# Altium project LMQ644_testpcb.PrjPcb
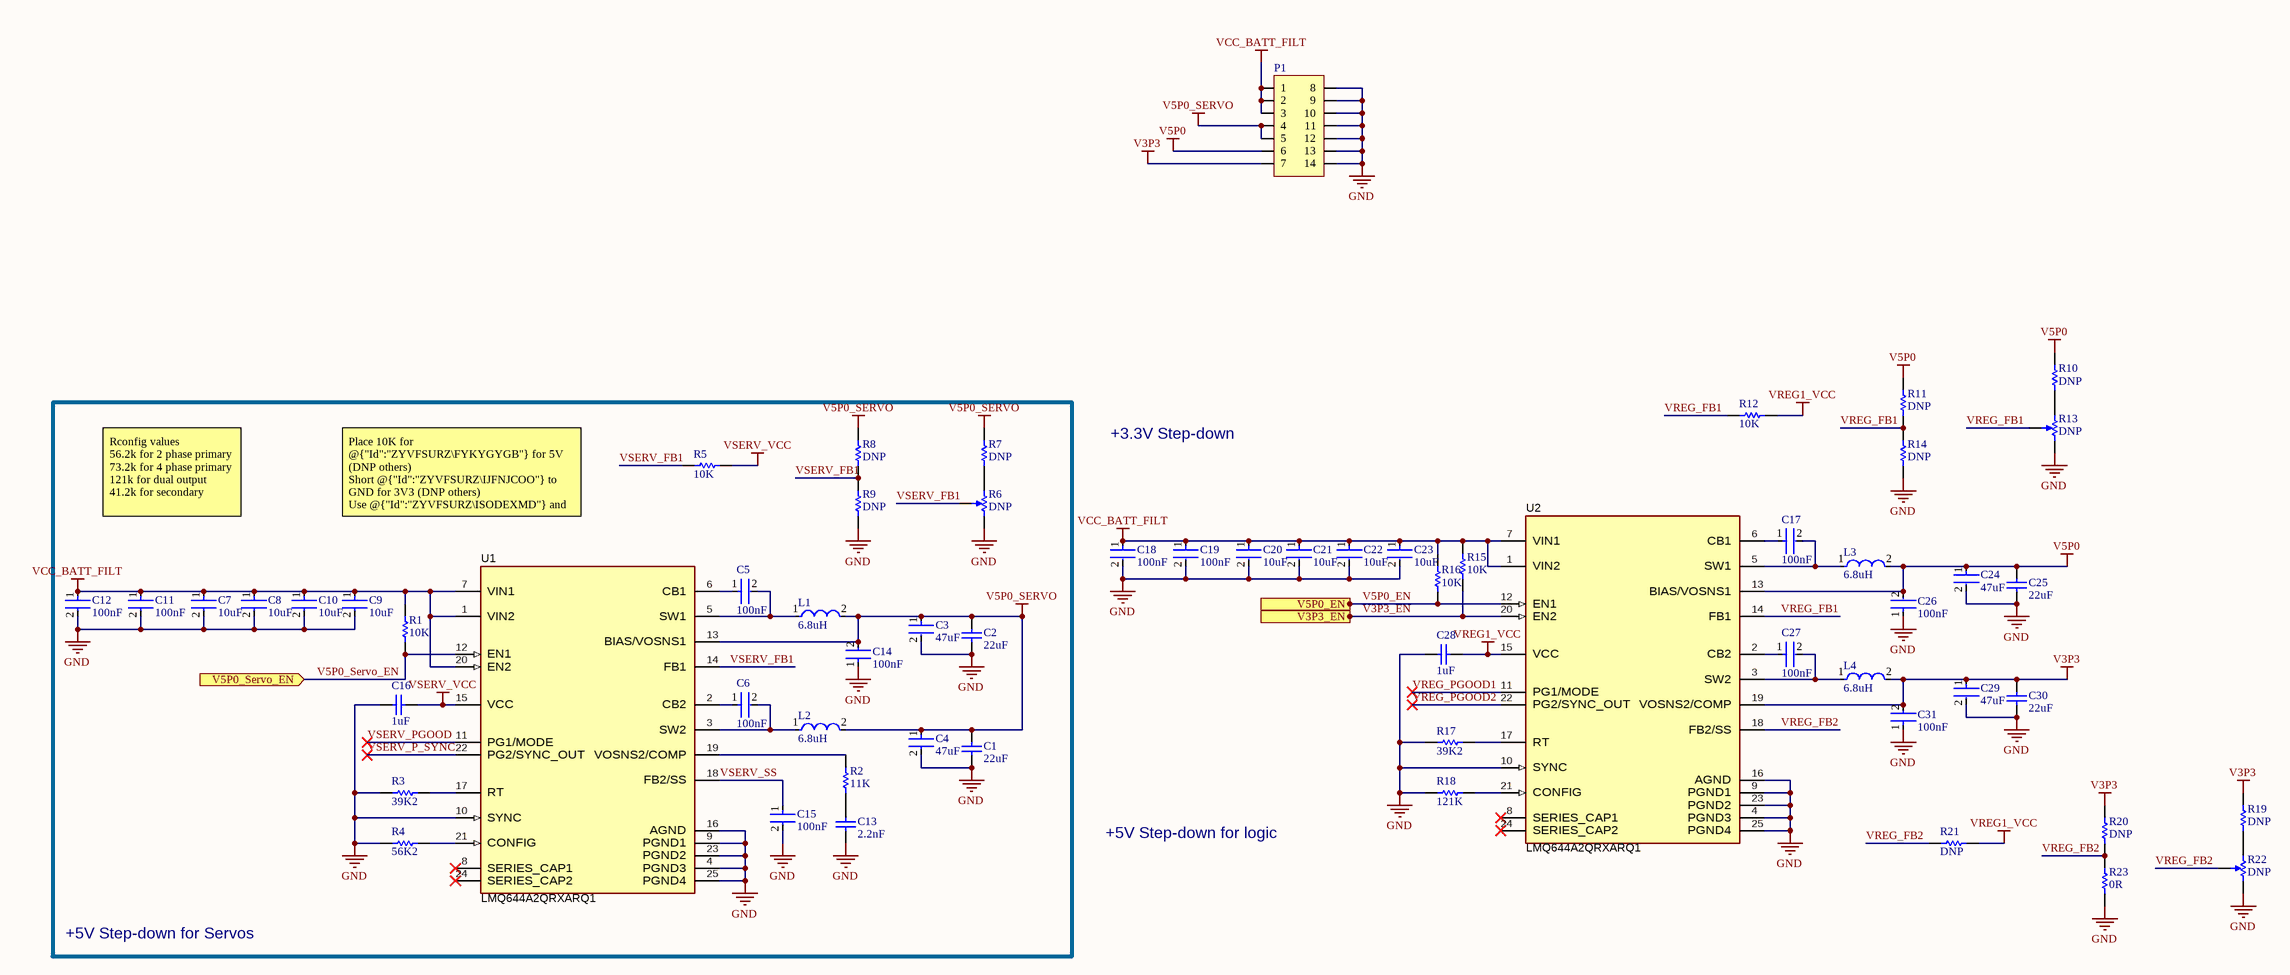
[diagram p0: LMQ644_test_SCH.SchDoc]
1 sheet, 61 parts. Net scope: flat (ports and power ports of the same name join across sheets).
Board file: LMQ644_test_PCB.PcbDoc

## Sheet LMQ644_test_SCH.SchDoc
size C; SheetNumber: 1; SheetTotal: 1

### Parts
C1  22uF  [CAPC1206(3216)190_L]
C2  22uF  [CAPC1206(3216)190_L]
C3  47uF  [FP-C3216-160-0_2-MFG]
C4  47uF  [FP-C3216-160-0_2-MFG]
C5  100nF  [FP-CGA3E-0_3-0_1-IPC_C]
C6  100nF  [FP-CGA3E-0_3-0_1-IPC_C]
C7  10uF  [FP-GRM32-MFG]
C8  10uF  [FP-GRM32-MFG]
C9  10uF  [FP-GRM32-MFG]
C10  10uF  [FP-GRM32-MFG]
C11  100nF  [FP-1206-L_3_2_0_2-W_1_6_0-MFG]
C12  100nF  [FP-1206-L_3_2_0_2-W_1_6_0-MFG]
C13  2.2nF  [CAPC1608X90X35NL10T15]
C14  100nF  [FP-CGA3E-0_3-0_1-IPC_C]
C15  100nF  [FP-CGA3E-0_3-0_1-IPC_C]
C16  1uF  [0603]
C17  100nF  [FP-CGA3E-0_3-0_1-IPC_C]
C18  100nF  [FP-1206-L_3_2_0_2-W_1_6_0-MFG]
C19  100nF  [FP-1206-L_3_2_0_2-W_1_6_0-MFG]
C20  10uF  [FP-GRM32-MFG]
C21  10uF  [FP-GRM32-MFG]
C22  10uF  [FP-GRM32-MFG]
C23  10uF  [FP-GRM32-MFG]
C24  47uF  [FP-C3216-160-0_2-MFG]
C25  22uF  [CAPC1206(3216)190_L]
C26  100nF  [FP-CGA3E-0_3-0_1-IPC_C]
C27  100nF  [FP-CGA3E-0_3-0_1-IPC_C]
C28  1uF  [0603]
C29  47uF  [FP-C3216-160-0_2-MFG]
C30  22uF  [CAPC1206(3216)190_L]
C31  100nF  [FP-CGA3E-0_3-0_1-IPC_C]
L1  6.8uH  [FP-IHLP-4040DZ-FP_3_124x3-MFG]
L2  6.8uH  [FP-IHLP-4040DZ-FP_3_124x3-MFG]
L3  6.8uH  [FP-IHLP-4040DZ-FP_3_124x3-MFG]
L4  6.8uH  [FP-IHLP-4040DZ-FP_3_124x3-MFG]
P1  14-Pin 2-Row Nano-Fit Right Angle  [MOLEX NANO-FIT 2X7 - Right Angle]  (value not drawn)
R1  10K  [0603]
R2  11K  [RESC1609X50X30LL10T20]
R3  39K2  [RESC1608X55X25LL10T15]
R4  56K2  [RESC1608X55X25LL10T15]
R5  10K  [0603]
R6  DNP  [BOUR-TC33X-2_V]  (no BOM)
R7  DNP  [0603]  (no BOM)
R8  DNP  [0603]
R9  DNP  [0603]
R10  DNP  [0603]  (no BOM)
R11  DNP  [0603]
R12  10K  [0603]
R13  DNP  [BOUR-TC33X-2_V]  (no BOM)
R14  DNP  [0603]  (no BOM)
R15  10K  [0603]
R16  10K  [0603]
R17  39K2  [RESC1608X55X25LL10T15]
R18  121K  [RESC1608X55X30LL15T15]
R19  DNP  [0603]  (no BOM)
R20  DNP  [0603]  (no BOM)
R21  DNP  [0603]  (no BOM)
R22  DNP  [BOUR-TC33X-2_V]  (no BOM)
R23  0R  [RESC1608X55X25LL10T15]
U1  LMQ644A2QRXARQ1  [RXA0024A-MFG]
U2  LMQ644A2QRXARQ1  [RXA0024A-MFG]

### Blocks framed on the sheet
+5V Step-down for Servos: C1-C16 L1 L2 R1-R9 U1

### Ports
V3P3_EN (in), V5P0_EN (in), V5P0_Servo_EN (in)

### Nets
GND: C1.1 C2.1 C3.2 C4.2 C7.2 C8.2 C9.2 C10.2 C11.2 C12.2 C13.2 C14.1 C15.2 C16.2 C18.2 C19.2 C20.2 C21.2 C22.2 C23.2 C24.2 C25.1 C26.1 C28.2 C29.2 C30.1 C31.1 P1.8 P1.9 P1.10 P1.11 P1.12 P1.13 P1.14 R3.1 R4.1 R6.3 R9.2 R13.3 R14.2 R17.1 R18.1 R22.3 R23.1 U1.4(PGND3) U1.9(PGND1) U1.10(SYNC) U1.16(AGND) U1.23(PGND2) U1.25(PGND4) U2.4(PGND3) U2.9(PGND1) U2.10(SYNC) U2.16(AGND) U2.23(PGND2) U2.25(PGND4)
V3P3: C29.1 C30.2 C31.2 L4.2 P1.7 R19.1 R20.1 U2.19(VOSNS2/COMP)
V5P0: C24.1 C25.2 C26.2 L3.2 P1.6 R10.1 R11.1 U2.13(BIAS/VOSNS1)
V5P0_SERVO: C1.2 C2.2 C3.1 C4.1 C14.2 L1.2 L2.2 P1.4 P1.5 R7.1 R8.1 U1.13(BIAS/VOSNS1)
VCC_BATT_FILT: C7.1 C8.1 C9.1 C10.1 C11.1 C12.1 C18.1 C19.1 C20.1 C21.1 C22.1 C23.1 P1.1 P1.2 P1.3 R1.2 R15.2 R16.2 U1.1(VIN2) U1.7(VIN1) U1.20(EN2) U2.1(VIN2) U2.7(VIN1)
VREG1_VCC: C28.1 R12.1 R21.2 U2.15(VCC)
VSERV_VCC: C16.1 R5.1 U1.15(VCC)
V3P3_EN: R15.1 U2.20(EN2) ; port V3P3_EN
V5P0_EN: R16.1 U2.12(EN1) ; port V5P0_EN
V5P0_Servo_EN: R1.1 U1.12(EN1) ; port V5P0_Servo_EN
VREG_FB1: R11.2 R12.2 R13.2 R14.1 U2.14(FB1)
VREG_FB2: R20.2 R21.1 R22.2 R23.2 U2.18(FB2/SS)
VREG_PGOOD1: U2.11(PG1/MODE)
VREG_PGOOD2: U2.22(PG2/SYNC_OUT)
VSERV_FB1: R5.2 R6.2 R8.2 R9.1 U1.14(FB1)
VSERV_P_SYNC: U1.22(PG2/SYNC_OUT)
VSERV_PGOOD: U1.11(PG1/MODE)
VSERV_SS: C15.1 U1.18(FB2/SS)
NetC5_1: C5.1 U1.6(CB1)
NetC5_2: C5.2 L1.1 U1.5(SW1)
NetC6_1: C6.1 U1.2(CB2)
NetC6_2: C6.2 L2.1 U1.3(SW2)
NetC13_1: C13.1 R2.2
NetC17_1: C17.1 U2.6(CB1)
NetC17_2: C17.2 L3.1 U2.5(SW1)
NetC27_1: C27.1 U2.2(CB2)
NetC27_2: C27.2 L4.1 U2.3(SW2)
NetR2_1: R2.1 U1.19(VOSNS2/COMP)
NetR3_2: R3.2 U1.17(RT)
NetR4_2: R4.2 U1.21(CONFIG)
NetR6_1: R6.1 R7.2
NetR10_2: R10.2 R13.1
NetR17_2: R17.2 U2.17(RT)
NetR18_2: R18.2 U2.21(CONFIG)
NetR19_2: R19.2 R22.1

Not connected (* = marked no-connect by the designer): U1 8(SERIES_CAP1)* 24(SERIES_CAP2)*; U2 8(SERIES_CAP1)* 24(SERIES_CAP2)*

### Notes on the sheet
- +3.3V Step-down
- Rconfig values
  56.2k for 2 phase primary
  73.2k for 4 phase primary
  121k for dual output
  41.2k for secondary
- Place 10K for @{"Id":"ZYVFSURZ\FYKYGYGB"} for 5V (DNP others)
  Short @{"Id":"ZYVFSURZ\IJFNJCOO"} to GND for 3V3 (DNP others)
  Use @{"Id":"ZYVFSURZ\ISODEXMD"} and @{"Id":"ZYVFSURZ\IJFNJCOO"} as a voltage divider to 0.8V for adjustable output
  Or place 10K resistor/pot for @{"Id":"ZYVFSURZ\DPEVPIVF"} and @{"Id":"ZYVFSURZ\MJWPYNBM"}
- +5V Step-down for logic

### Library data of the parts
C1 C2 C25 C30 = CMP-1037-04986-1: CAP 22uF 6.3V ±20% 1206 (3216 Metric) Thickness 1.9mm SMD; Case-EIA: 1206; Tolerance: Â±20%; Case-Metric: 3216; Value: 22uF; Max Thickness: 1.9 mm; Rated Voltage: 6.3 V; Technology: SMT
C3 C4 C24 C29 = CMP-2000-07442-2: Multilayer Ceramic Capacitors 47uF ±20% 16V X5R SMD 1206 / C3216X5R1C476M160AB; Resistor Type: Ceramic; Width: 0.063inch; Case Code (Imperial): 1206; Radiation Hardening: No; Thickness: 0.071inch; Dielectric: X5R; Weight: 0.000571oz; Termination: SMD/SMT; Dielectric Material: Ceramic; Min Operating Temperature: -55°C; Depth: 1.6mm; Case Code (Metric): 3216; Max Operating Temperature: 85°C; RoHS Compliant: Yes; REACH SVHC: No SVHC; Mount: Surface Mount; Lead Free: Lead Free; Height: 1.6mm; Length: 3.2mm; Tolerance: 20%; Voltage Rating (DC): 16V; Capacitance: 47uF; Package Quantity: 1; Construction: Flat; Packaging: Tape and Reel; Series: C; Case/Package: 1206; Voltage Rating: 16V
C5 C6 C14 C15 C17 C26 C27 C31 = CMP-2000-07546-2: Cap Ceramic 100nF 50V X7R 10% Pad SMD 0603 +125°C Automotive T/R / CGA3E2X7R1H104K080AA; Weight: 7.1E-05oz; Composition: Ceramic; Max Operating Temperature: 125°C; Termination: SMD/SMT; Dielectric: X7R; Length: 1.6mm; Package Quantity: 1; REACH SVHC: No SVHC; Lead Free: Lead Free; Case Code (Metric): 1608; Min Operating Temperature: -55°C; Packaging: Tape and Reel; Tolerance: 10%; Voltage Rating: 50V; Case Code (Imperial): 0603; Capacitance: 100nF; Case/Package: 0603; Voltage Rating (DC): 50V; Depth: 0.8mm; Radiation Hardening: No; Ratings: AEC-Q200; Mount: Surface Mount; Voltage: 50V; Thickness: 0.035inch; Width: 0.8mm; Height: 0.8mm
C7-C10 C20-C23 = CMP-2000-05261-2: CAP CER 10UF 50V X7R 1210; Manufacturer Part Number: GRM32ER71H106KA12L; Manufacturer: Murata; Tolerance: 10%; Material: Ceramic; Temperature Coefficient: 15%; Voltage Rating: 50V; Temperature Characteristic: X7R; Value: 10uF; ComponentLink2Description: Datasheet; Device Class L1: Passive Components; Lead Free: Yes; Temperature Range High: +125°C; Category: Cap; ComponentLink2URL: https://search.murata.co.jp/Ceramy/image/img/A01X/G101/ENG/GRM32ER71H106KA12-01.pdf; Device Class L2: Capacitors; Package: GRM32; Mouser Description: 1210 10 uF 50 V ±10% Tolerance X7R SMT Multilayer Ceramic Capacitor; Capacitance: 10uF; Octopart: https://octopart.com/grm32er71h106ka12l-murata-10470987; Digikey Description: CAP CER 10UF 50V X7R 1210; Height: 2.7mm; Temperature: -55°C to +125°C; Temperature Range Low: -55°C; RoHS: TRUE; Device Class L3: Ceramic Capacitors; Automotive: No
C11 C12 C18 C19 = CMP-04427-006943-1: General Purpose Ceramic Capacitor, 1206, 100nF, 20%, X5R, 15%, 25V; Dissipation Factor: 12.5%; Insulation Resistance: 10GR; Capacitance: 10uF; Case Code (Imperial): 1206; Series: -; Construction: Flat; Termination: SMD/SMT; Case/Package: 1206; Dielectric: X5R; Width: 1.6mm; Max Operating Temperature: 85°C; Height: 0.07mm; Package Quantity: 1; Depth: 1.6mm; Voltage Rating: 25V; RoHS Compliant: Yes; Mount: Surface Mount; Radiation Hardening: No; Voltage Rating (DC): 25V; Number of Pins: 2; Contact Plating: Tin; Min Operating Temperature: -55°C; Lead Free: Lead Free; Packaging: Tape and Reel; Tolerance: 20%; Case Code (Metric): 3216; Thickness: 0.07inch; Length: 3.2mm; REACH SVHC: No SVHC
C13 = CMP-2006-02908-5: Chip Capacitor, 2.2 nF, +/- 10%, 50 V, -55 to 125 degC, 0603 (1608 Metric), RoHS, Tape and Reel / GRM188R71H222KA01D; Manufacturer: Murata; Voltage Rating: 50 V; Pins: 2; Mount: Surface Mount; Max Operating Temperature: 125 degC; ComponentLink1Description: Manufacturer URL; RoHSCompliant: true; PackageDescription: 2-Pin Surface Mount Device, Body 1.6 x 0.8 mm; ComponentLink2URL: http://search.murata.co.jp/Ceramy/image/img/A01X/G101/ENG/GRM188R71H222KA01-01.pdf; PackageReference: 0603; Height: 0.8 mm; Lead Pitch: 4 mm; Packaging: Tape and Reel; DatasheetVersion: 02/2016; Mounting Technology: Surface Mount; ComponentLink2Description: Datasheet; Min Operating Temperature: -55 degC; Length: 1.6 mm; REACH SVHC: No SVHC; Package Quantity: 4000; ComponentLink1URL: http://www.murata.com/
C16 C28 = 1uF 0603: CAP 1uF 25V ±10% 0603 (1608 Metric) Thickness 1mm SMD; Tolerance: Â±10%; Case-Metric: 1608; Technology: SMT; Rated Voltage: 25 V; Case-EIA: 0603; Max Thickness: 1 mm; Value: 1uF; ComponentLink1Description: Link; ComponentLink1URL: https://www.digikey.com/en/products/detail/samsung-electro-mechanics/CL10B105KA8NNNC/3886842
L1-L4 = CMP-02424-000228-1: Commercial Inductors, High Saturation Series 6.8uH 8A 23.3mΩ 20% / IHLP4040DZER6R8M01; Saturation Current: 13.5A; Core Material: Metal; Shielding: Shielded; Self Resonant Frequency: 5MHz; Test Frequency: 100kHz; DC Resistance (DCR): 23.3mR; Current Rating: 8A; Contact Plating: Tin; Width: 0.405inch; RMS Current (Irms): 8A; Package Quantity: 500; Case/Package: 4040; Tolerance: 20%; Inductance Tolerance: 20%; Packaging: Tape and Reel; Max Operating Temperature: 125°C; Height - Seated (Max): 0.157inch; Termination: SMD/SMT; Length: 0.43inch; Inductance: 6.8uH; Max DC Current: 13.5A; Number of Pins: 4040; Min Operating Temperature: -55°C; Lead Free: Lead Free; Height: 4mm; Radiation Hardening: No; Military Standard: Not; Mount: Surface Mount; Depth: 10.3mm
P1 = 14-Pin 2-Row Nano-Fit Right Angle: NanoFit Right Hdr TH DR 14Ckt; Part Number: 105314-1214; Manufacturer: Molex; Supplier: Mouser; Supplier Part Number: 538-105314-1214; Supplier 1: Mouser; Supplier Part Number 1: 538-105314-1214; ComponentLink1Description: Mouser Link; ComponentLink1URL: https://www.mouser.com/ProductDetail/Molex/105314-1214?qs=PqFvFmEiOr6wLIXpvlvqbA%3D%3D; ComponentLink2Description: Link; ComponentLink2URL: https://www.digikey.com/en/products/detail/molex/1053141114/7693193
R1 R5 R7 R10 R12 R15 R16 R19 = 10K 0603: Chip Resistor, 10 KOhm, +/- 1%, 100 mW, -55 to 155 degC, 0603 (1608 Metric), RoHS, Tape and Reel; Manufacturer: Vishay Semiconductor; Voltage Rating: 75 V; Max Operating Temperature: 155 degC; PackageDescription: 2-Pin Surface Mount Device, Body 1.575 x 0.85 mm; ComponentLink1Description: Manufacturer URL; RoHSCompliant: true; PackageReference: 0603; REACH SVHC: Unknown; Length: 1.55 mm; DatasheetVersion: 06/2012; Packaging: Tape and Reel; Min Operating Temperature: -55 degC; Mounting Technology: Surface Mount; ComponentLink2URL: https://datasheet.ciiva.com/11809/0900766b80d98afc-11809037.pdf; Height: 0.45 mm; ComponentLink2Description: Datasheet; Package Quantity: 5000; ComponentLink1URL: http://www.vishay.com/; ComponentLink3Description: Link; ComponentLink3URL: https://www.digikey.com/en/products/detail/stackpole-electronics-inc/RNCP0603FTD10K0/2240139
R2 = CMP-2000-03860-1: CRCW060311K0FKEA / 11K 0603; Manufacturer: Vishay Dale; Part Number: CRCW060311K0FKEA
R3 R17 = CMP-2000-04034-1: RC0603FR-0739K2L / 0603 39.2k; Manufacturer: Yageo; Part Number: RC0603FR-0739K2L
R4 = CMP-1659-00050-1: Chip Resistor, 56.2 KOhm, +/- 1%, 0.1 W, -55 to 155 degC, 0603 (1608 Metric), RoHS, Tape and Reel / RC0603FR-0756K2L; Gender: Female; Connector Type: USB; Voltage Rating: 30 V; Current Rating: 1 A; Packaging: Tray; Package Quantity: 24000; PackageDescription: 2-Pin Surface Mount Device, Body 1.6 x 0.8 mm; DatasheetVersion: Rev. 4, 02/2016; PackageReference: 0603; Length: 14.5 mm; Contact Material: Copper; ComponentLink2Description: Datasheet; Radiation Hardening: No; Max Operating Temperature: 50 degC; Width: 7.12 mm; RoHSCompliant: true; Contact Plating: Gold; Pins: 4; Colour: Black; ComponentLink1Description: Manufacturer URL; Min Operating Temperature: 0 degC; ComponentLink2URL: http://www.yageo.com/documents/recent/PYu-RC_Group_51_RoHS_L_04.pdf; Height: 15 mm; ComponentLink1URL: http://www.yageo.com/; Mount: Through Hole; REACH SVHC: Unknown
R6 R13 R22 = CMP-2100-03695-1: Trimming Potentiometer, 10000 Ohm, -40 to 100 degC, 3-Pin SMD, RoHS, Tape and Reel / TC33X-2-103E; Manufacturer: Bourns; Tolerance: 25%; Max Power Dissipation: 100mW; Number of Turns: 1; Resistance: 10KOhm; Temperature Coefficient: 250ppm/degreesC; Voltage Rating (DC): 50V; Datasheet URL: http://www.bourns.com/docs/Product-Datasheets/TC33.pdf; Composition: Potentiometer; Package Description: 3-Pin Surface Mount Device, Body 3.8 x 3.6 mm; Weight: 29.4mg; Power Rating: 100mW; Termination: FootPrint; Manufacturer URL: http://www.bourns.com/; Width: 0.118inch; Height: 0.047inch; Military Standard: Not; Radiation Hardening: No; Colour: Silver; Case/Package: SMD/SMT; Depth: 3.8mm; Min Operating Temperature: -40degC; Lead Free: LeadFree; Datasheet Version: 42583.0; REACH SVHC: NoSVHC; Length: 3mm; RoHSCompliant: true; Contact Plating: Silver; Taper: Linear; Packaging: TapeandReel; Mount: SurfaceMount; Max Operating Temperature: 100degC; Package Reference: TC33X-2; Package Quantity: 2500
R8 R9 R11 R14 R20 R21 = DNP 0603 R: DNP 0603 Resistor; Case-Metric: 1608; Case-EIA: 0603
R18 = CMP-2000-00221-1: 0603 121K / ERJ-3EKF1213V; Manufacturer: Panasonic; Part Number: ERJ-3EKF1213V
R23 = CMP-2100-03667-1: Chip Resistor, 0 Ohm, +/- 5%, 0.1 W, -55 to 155 degC, 0603 (1608 Metric), RoHS, Tape and Reel / RC0603JR-070RL; Manufacturer: Yageo; Temperature Coefficient: 200ppm/degreesC; Voltage Rating: 50V; Power Rating: 100mW; Resistance: 0mOhm; Width: 0.8mm; Max Operating Temperature: 155degC; Tolerance: 5%; Package Reference: 0603; Height: 0.45mm; Depth: 0.8mm; Package Description: 2-Pin Surface Mount Device, Body 1.6 x 0.8 mm; Termination: SMD/SMT; Package Quantity: 5000; Case/Package: 0603; Case Code (Imperial): 0603; Radiation Hardening: No; Number of Pins: 2; Length: 1.6mm; Lead Free: LeadFree; Voltage Rating (DC): 50V; Military Standard: Not; Datasheet URL: http://www.yageo.com/NewPortal/yageodocoutput?fileName=/pdf/R-Chip/PYu-RC_Group_51_RoHS_L_5.pdf; Manufacturer URL: http://www.yageo.com/; Packaging: TapeandReel; Case Code (Metric): 1608; Min Operating Temperature: -55degC; Composition: ThickFilm; RoHSCompliant: true; Contact Plating: Tin; Datasheet Version: Rev. 5, 10/2016; REACH SVHC: NoSVHC
U1 U2 = SYM-LMQ644A2QRXARQ1: LMQ644A2-Q1 3-V to 36-V, 12A, Low Iq dual buck converter; Manufacturer: Texas Instruments; Min Supply Voltage: 3V; Max Duty Cycle: 99%; TaMin_C: -40°C; Output Voltage: 0.8-20V; AEC Grade: Grade 1; Output Type: Fixed,AdjustableProgrammable; TaMax_C: +125°C; AEC Qualified: Yes; SizeZ_mm: 0.7mm; TJmax_C: +150°C; Max Supply Voltage: 36V; Switching Frequency: 0.1-2.2MHz; Number Of Outputs: 2; Standoff Height: 0mm; Nominal Supply Current: 9-25uA; PackageReference: WQFN-FCRLF24; Datasheet Path: datasheets/IC-LMQ644A2QRXARQ1.pdf; Part Number: LMQ644A2QRXARQ1; Switching Topology: Buck; RoHS: UNKNOWN; Operating Temperature Range: -40°C to +150°C; helpURL: https://upverter.com/upn/revision/84824370b23b6079/; PartNumber: LMQ644A2QRXARQ1